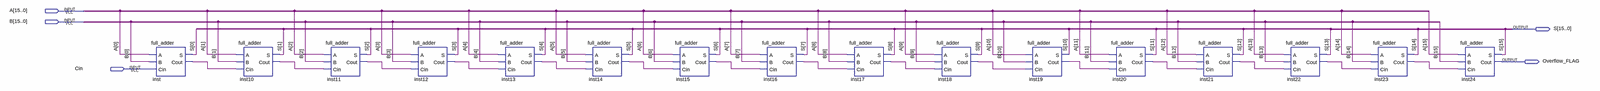
[diagram p0: schematic sheet, whole]
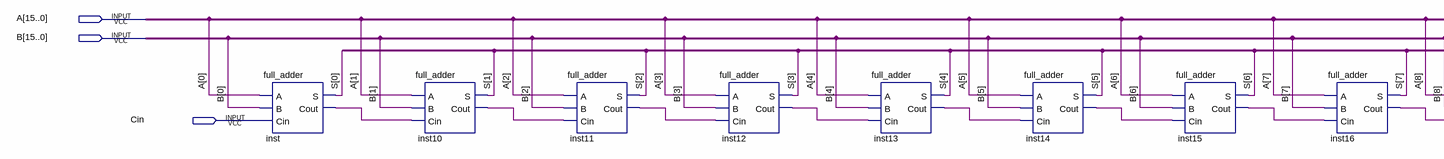
[diagram p1: schematic sheet, left part]
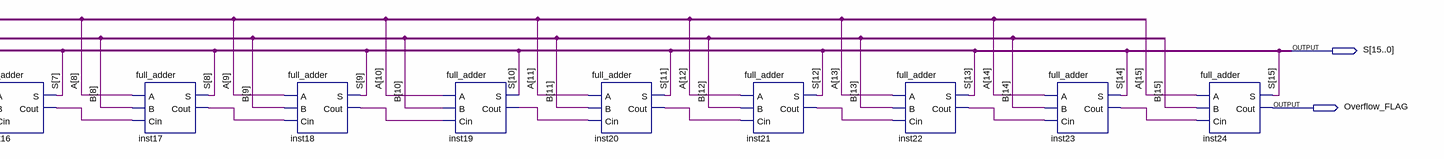
[diagram p2: schematic sheet, right part]
// Quartus schematic adder_16bit.bdf as structural Verilog: 16 symbols, 5 pins
module adder_16bit (
  input  [15:0] A,
  input  [15:0] B,
  input  Cin,
  output [15:0] S,
  output Overflow_FLAG
);

  wire inst10_cout, inst11_cout, inst12_cout, inst13_cout, inst14_cout, inst15_cout, inst16_cout,
       inst17_cout, inst18_cout, inst19_cout, inst20_cout, inst21_cout, inst22_cout, inst23_cout, inst_cout;

  full_adder inst (.A(A[0]), .B(B[0]), .Cin(Cin), .S(S[0]), .Cout(inst_cout));
  full_adder inst10 (.A(A[1]), .B(B[1]), .Cin(inst_cout), .S(S[1]), .Cout(inst10_cout));
  full_adder inst11 (.A(A[2]), .B(B[2]), .Cin(inst10_cout), .S(S[2]), .Cout(inst11_cout));
  full_adder inst12 (.A(A[3]), .B(B[3]), .Cin(inst11_cout), .S(S[3]), .Cout(inst12_cout));
  full_adder inst13 (.A(A[4]), .B(B[4]), .Cin(inst12_cout), .S(S[4]), .Cout(inst13_cout));
  full_adder inst14 (.A(A[5]), .B(B[5]), .Cin(inst13_cout), .S(S[5]), .Cout(inst14_cout));
  full_adder inst15 (.A(A[6]), .B(B[6]), .Cin(inst14_cout), .S(S[6]), .Cout(inst15_cout));
  full_adder inst16 (.A(A[7]), .B(B[7]), .Cin(inst15_cout), .S(S[7]), .Cout(inst16_cout));
  full_adder inst17 (.A(A[8]), .B(B[8]), .Cin(inst16_cout), .S(S[8]), .Cout(inst17_cout));
  full_adder inst18 (.A(A[9]), .B(B[9]), .Cin(inst17_cout), .S(S[9]), .Cout(inst18_cout));
  full_adder inst19 (.A(A[10]), .B(B[10]), .Cin(inst18_cout), .S(S[10]), .Cout(inst19_cout));
  full_adder inst20 (.A(A[11]), .B(B[11]), .Cin(inst19_cout), .S(S[11]), .Cout(inst20_cout));
  full_adder inst21 (.A(A[12]), .B(B[12]), .Cin(inst20_cout), .S(S[12]), .Cout(inst21_cout));
  full_adder inst22 (.A(A[13]), .B(B[13]), .Cin(inst21_cout), .S(S[13]), .Cout(inst22_cout));
  full_adder inst23 (.A(A[14]), .B(B[14]), .Cin(inst22_cout), .S(S[14]), .Cout(inst23_cout));
  full_adder inst24 (.A(A[15]), .B(B[15]), .Cin(inst23_cout), .S(S[15]), .Cout(Overflow_FLAG));
endmodule
